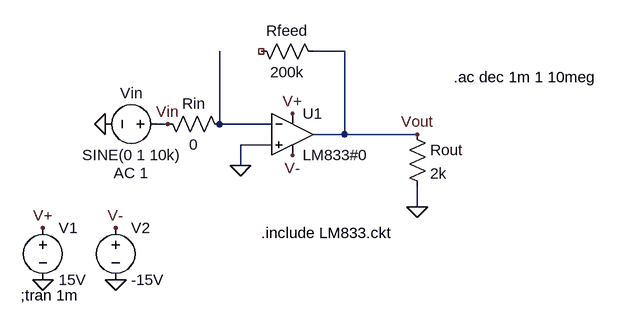
[diagram p0: schematic Test de polo Dominante.asc]
Test de polo Dominante.asc, the LTspice schematic file:
Version 4
SHEET 1 880 680
WIRE 304 32 256 32
WIRE 32 144 16 144
WIRE 112 144 112 32
WIRE 192 144 112 144
WIRE 304 160 304 32
WIRE 304 160 256 160
WIRE 416 160 304 160
WIRE 192 176 144 176
WIRE 144 208 144 176
WIRE 416 272 416 240
FLAG 144 208 0
FLAG -48 384 0
FLAG -160 384 0
FLAG -160 304 V+
FLAG 224 128 V+
FLAG -48 304 V-
FLAG 224 192 V-
FLAG 416 160 Vout
FLAG -64 144 0
FLAG 32 144 Vin
FLAG 416 272 0
SYMBOL Opamps\\opamp2 224 96 R0
SYMATTR InstName U1
SYMATTR Value LM833#0
SYMBOL voltage -160 288 R0
WINDOW 123 0 0 Left 0
WINDOW 39 0 0 Left 0
SYMATTR InstName V1
SYMATTR Value 15V
SYMBOL voltage -48 288 R0
WINDOW 123 0 0 Left 0
WINDOW 39 0 0 Left 0
SYMATTR InstName V2
SYMATTR Value -15V
SYMBOL voltage 32 144 R90
WINDOW 0 -32 56 VBottom 2
WINDOW 3 32 56 VTop 2
WINDOW 123 60 56 VTop 2
WINDOW 39 0 0 Left 0
SYMATTR InstName Vin
SYMATTR Value SINE(0 1 10k)
SYMATTR Value2 AC 1
SYMBOL res 160 16 M90
WINDOW 0 0 56 VBottom 2
WINDOW 3 32 56 VTop 2
SYMATTR InstName Rfeed
SYMATTR Value 200k
SYMBOL res 16 128 M90
WINDOW 0 0 56 VBottom 2
WINDOW 3 32 56 VTop 2
SYMATTR InstName Rin
SYMATTR Value 0
SYMBOL res 400 144 R0
SYMATTR InstName Rout
SYMATTR Value 2k
TEXT 176 312 Left 2 !.include LM833.ckt
TEXT -194 408 Left 2 !;tran 1m
TEXT 472 72 Left 2 !.ac dec 1m 1 10meg

The netlist it stands for:
* Test de polo Dominante.asc
XU1 0 N001 V+ V- Vout LM833#0  ; pins In+ In- V+ V- OUT
V1 V+ 0 15V
V2 V- 0 -15V
Vin Vin 0 SINE(0 1 10k) AC 1
Rfeed NC_01 Vout 200k
Rin Vin N001 0
Rout Vout 0 2k
.include LM833.ckt
;tran 1m
.ac dec 1m 1 10meg
.backanno
.end